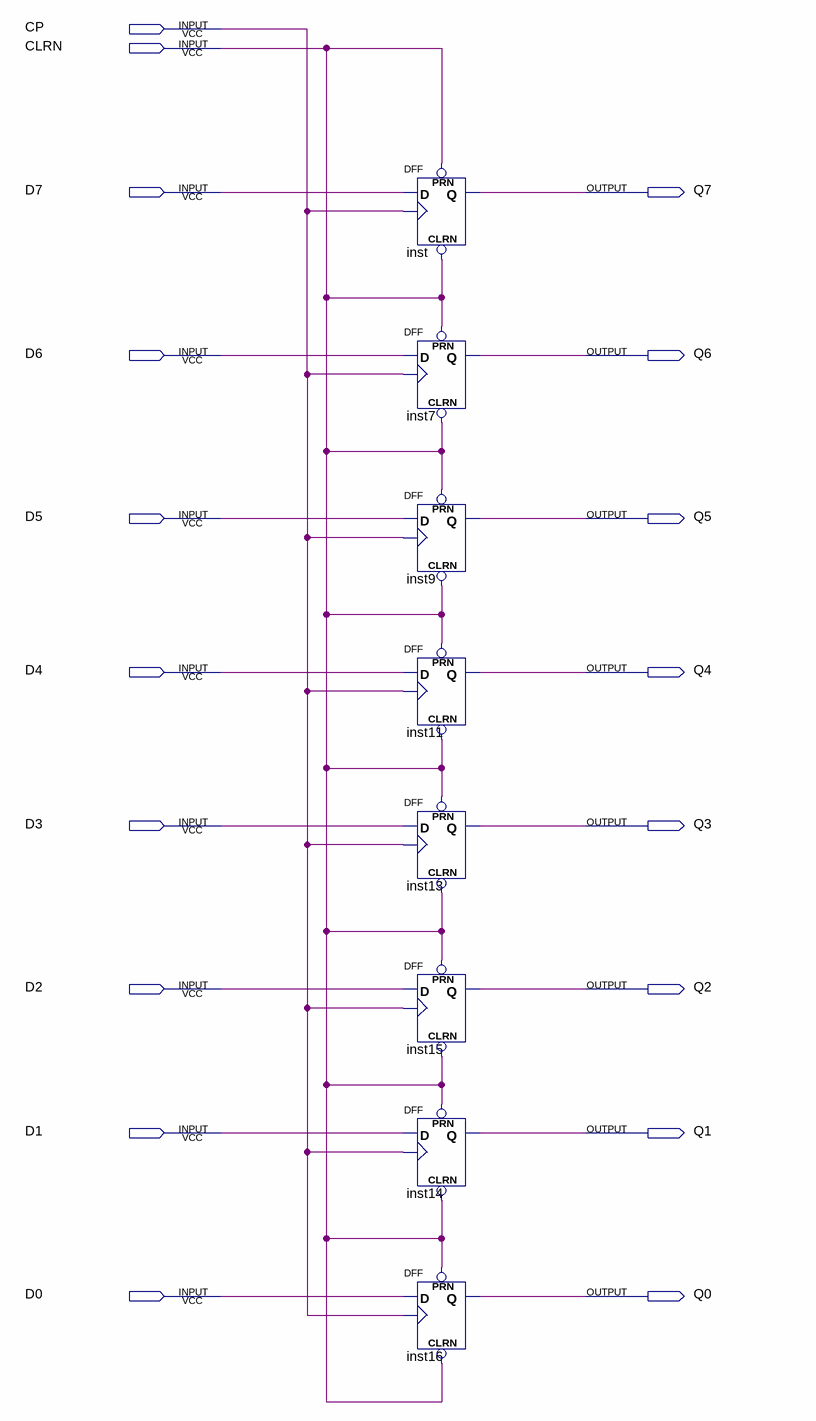
[diagram p0: schematic sheet]
// Quartus schematic register8_with_clrn.bdf as structural Verilog: 8 symbols, 18 pins
module register8_with_clrn (
  input  CP,
  input  CLRN,
  input  D7,
  input  D6,
  input  D5,
  input  D4,
  input  D3,
  input  D2,
  input  D1,
  input  D0,
  output Q7,
  output Q6,
  output Q5,
  output Q4,
  output Q3,
  output Q2,
  output Q1,
  output Q0
);

  DFF inst (.CLRN(CLRN), .CLK(CP), .D(D7), .PRN(CLRN), .Q(Q7));
  DFF inst7 (.CLRN(CLRN), .CLK(CP), .D(D6), .PRN(CLRN), .Q(Q6));
  DFF inst9 (.CLRN(CLRN), .CLK(CP), .D(D5), .PRN(CLRN), .Q(Q5));
  DFF inst11 (.CLRN(CLRN), .CLK(CP), .D(D4), .PRN(CLRN), .Q(Q4));
  DFF inst13 (.CLRN(CLRN), .CLK(CP), .D(D3), .PRN(CLRN), .Q(Q3));
  DFF inst15 (.CLRN(CLRN), .CLK(CP), .D(D2), .PRN(CLRN), .Q(Q2));
  DFF inst14 (.CLRN(CLRN), .CLK(CP), .D(D1), .PRN(CLRN), .Q(Q1));
  DFF inst16 (.CLRN(CLRN), .CLK(CP), .D(D0), .PRN(CLRN), .Q(Q0));
endmodule
